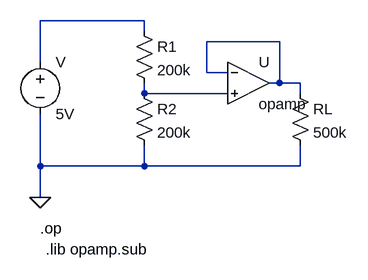
[diagram p0: schematic T4_5_opamp.asc]
T4_5_opamp.asc, the LTspice schematic file:
Version 4
SHEET 1 880 680
WIRE 272 48 112 48
WIRE 272 64 272 48
WIRE 480 80 368 80
WIRE 112 112 112 48
WIRE 368 128 368 80
WIRE 400 128 368 128
WIRE 480 144 480 80
WIRE 480 144 464 144
WIRE 512 144 480 144
WIRE 272 160 272 144
WIRE 400 160 272 160
WIRE 512 160 512 144
WIRE 112 272 112 192
WIRE 272 272 272 240
WIRE 272 272 112 272
WIRE 512 272 512 240
WIRE 512 272 272 272
WIRE 112 320 112 272
FLAG 112 320 0
SYMBOL res 256 144 R0
SYMATTR InstName R2
SYMATTR Value 200k
SYMBOL voltage 112 96 R0
SYMATTR InstName V
SYMATTR Value 5V
SYMBOL res 256 48 R0
SYMATTR InstName R1
SYMATTR Value 200k
SYMBOL opamp 432 80 R0
SYMATTR InstName U
SYMBOL res 496 144 R0
SYMATTR InstName RL
SYMATTR Value 500k
TEXT 112 368 Left 2 !.op
TEXT 120 400 Left 2 !.lib opamp.sub

The netlist it stands for:
* T4_5_opamp.asc
R2 N003 0 200k
V N001 0 5V
R1 N001 N003 200k
XU N002 N003 N002 opamp Aol=100K GBW=10Meg  ; pins invin noninvin out
RL N002 0 500k
.op
.lib opamp.sub
.backanno
.end